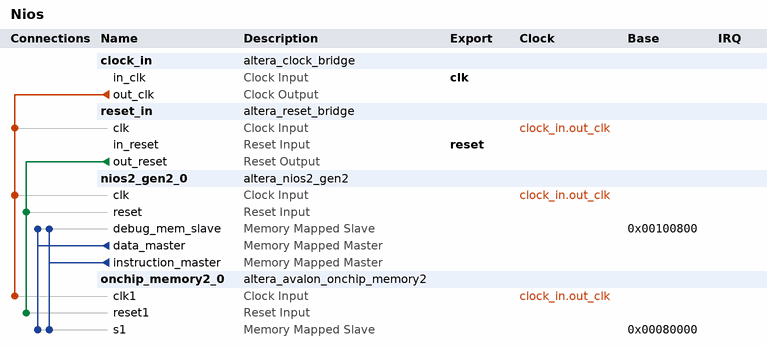
[diagram p0: system contents]
# Platform Designer (Qsys) system Nios, Arria 10 10AT115S2F45E2SG
# Parameters at their usual value, and those the tool derives, are not listed.
package require -exact qsys 1.0
create_system Nios
set_project_property DEVICE_FAMILY {Arria 10}
set_project_property DEVICE 10AT115S2F45E2SG

add_component clock_in ip/Nios/Nios_clock_in.ip altera_clock_bridge clock_in 17.1
load_component clock_in
set_component_parameter_value DERIVED_CLOCK_RATE 0
set_component_parameter_value EXPLICIT_CLOCK_RATE 50000000
save_component

add_component reset_in ip/Nios/Nios_reset_in.ip altera_reset_bridge reset_in 17.1
load_component reset_in
set_component_parameter_value ACTIVE_LOW_RESET 0
set_component_parameter_value SYNCHRONOUS_EDGES deassert
save_component

add_component nios2_gen2_0 ip/Nios/Nios_nios2_gen2_0.ip altera_nios2_gen2 nios2_gen2_0 17.1
load_component nios2_gen2_0
set_component_parameter_value resetSlave onchip_memory2_0.s1
set_component_parameter_value exceptionSlave onchip_memory2_0.s1
set_component_parameter_value impl Fast
set_component_parameter_value icache_size 2048
set_component_parameter_value dcache_size 2048
save_component

add_component onchip_memory2_0 ip/Nios/Nios_onchip_memory2_0.ip altera_avalon_onchip_memory2 onchip_memory2_0 17.1
load_component onchip_memory2_0
set_component_parameter_value dataWidth 32
set_component_parameter_value dualPort false
set_component_parameter_value initMemContent true
set_component_parameter_value initializationFileName onchip_mem.hex
set_component_parameter_value memorySize 409600
save_component

# connections
add_connection clock_in.out_clk nios2_gen2_0.clk clock
add_connection clock_in.out_clk onchip_memory2_0.clk1 clock
add_connection clock_in.out_clk reset_in.clk clock
add_connection reset_in.out_reset nios2_gen2_0.reset reset
add_connection reset_in.out_reset onchip_memory2_0.reset1 reset
add_connection nios2_gen2_0.data_master nios2_gen2_0.debug_mem_slave avalon
set_connection_parameter_value nios2_gen2_0.data_master/nios2_gen2_0.debug_mem_slave baseAddress 0x00100800
add_connection nios2_gen2_0.data_master onchip_memory2_0.s1 avalon
set_connection_parameter_value nios2_gen2_0.data_master/onchip_memory2_0.s1 baseAddress 0x00080000
add_connection nios2_gen2_0.instruction_master nios2_gen2_0.debug_mem_slave avalon
set_connection_parameter_value nios2_gen2_0.instruction_master/nios2_gen2_0.debug_mem_slave baseAddress 0x00100800
add_connection nios2_gen2_0.instruction_master onchip_memory2_0.s1 avalon
set_connection_parameter_value nios2_gen2_0.instruction_master/onchip_memory2_0.s1 baseAddress 0x00080000

# exported interfaces
add_interface clk clock sink
set_interface_property clk EXPORT_OF clock_in.in_clk
add_interface reset reset sink
set_interface_property reset EXPORT_OF reset_in.in_reset

set_interconnect_requirement {$system} qsys_mm.clockCrossingAdapter HANDSHAKE
set_interconnect_requirement {$system} qsys_mm.enableEccProtection FALSE
set_interconnect_requirement {$system} qsys_mm.insertDefaultSlave FALSE
set_interconnect_requirement {$system} qsys_mm.maxAdditionalLatency 1

save_system Nios.qsys
